# Altium schematic sheet 05-nRF52840.SchDoc: nRF52840
size 297 x 209 mm; Author: Dmitry Shpakov; Organization: NoName; Revision: Revision; PageSize: A4; ProjectName: Project Name
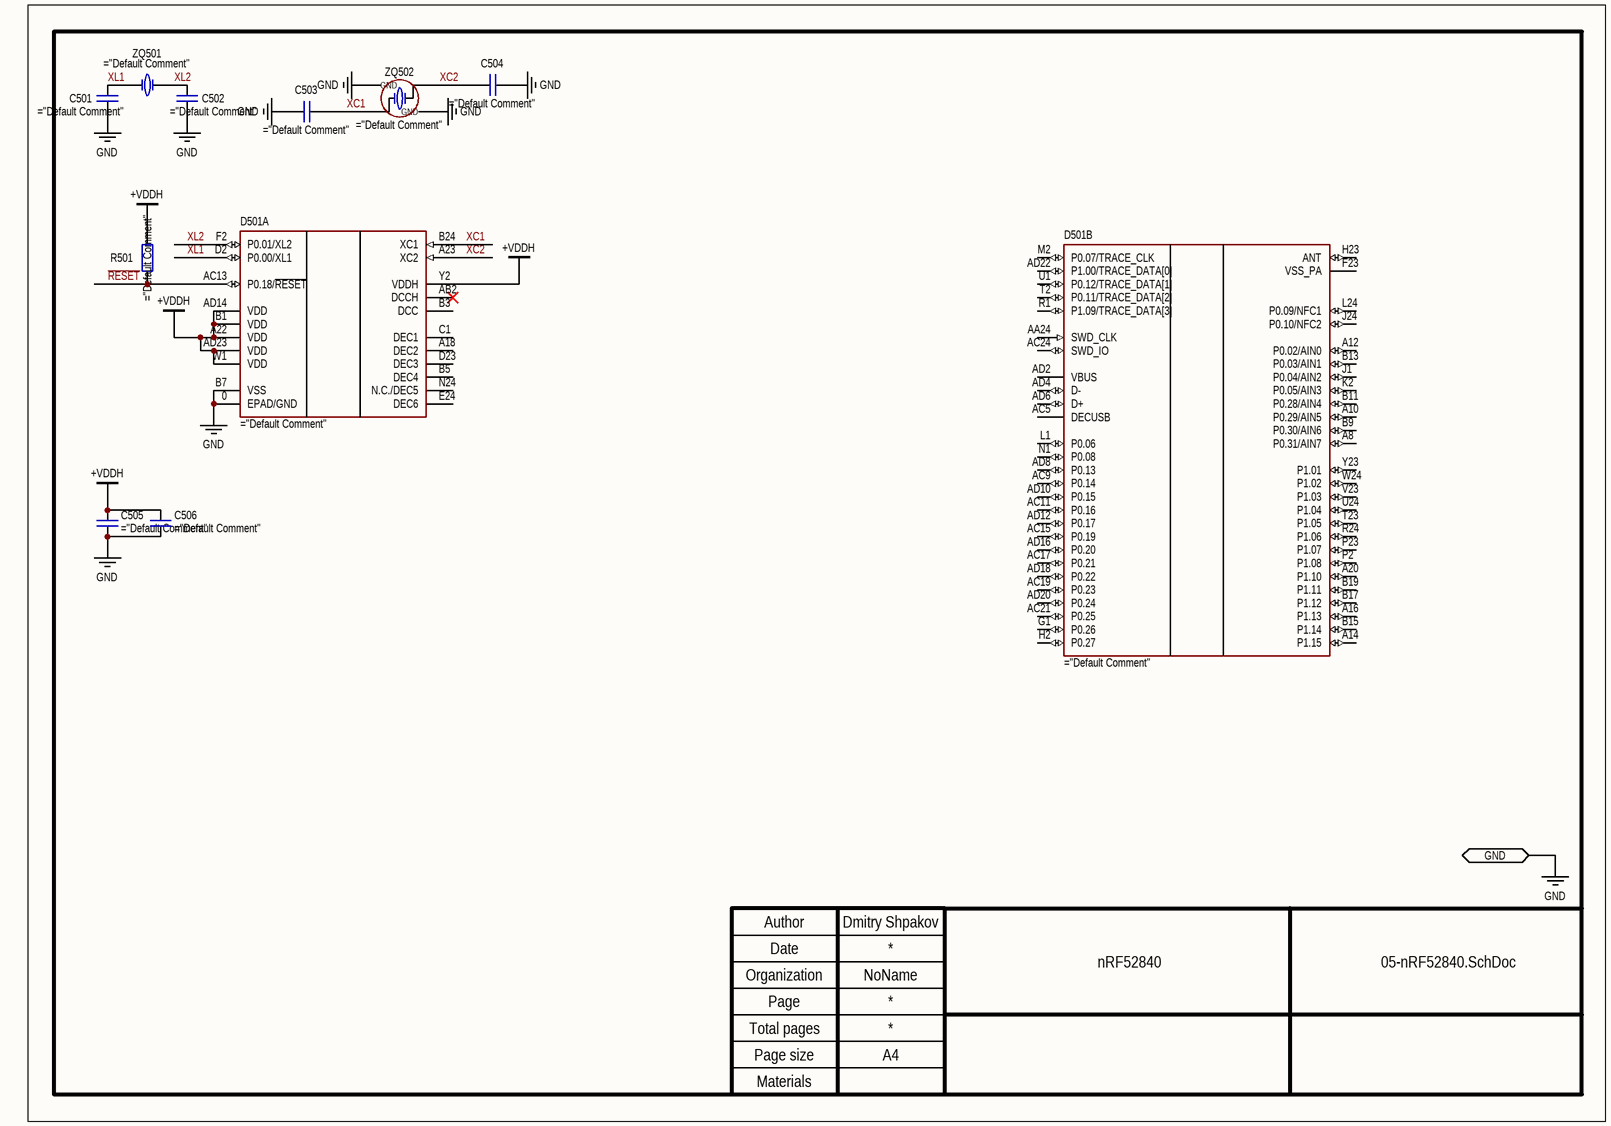
[diagram p0: 05-nRF52840.SchDoc]

## Parts
C501  (no value)  [CAP0402MD]
C502  (no value)  [CAP0402MD]
C503  (no value)  [CAP0402MD]
C504  (no value)  [CAP0402MD]
C505  (no value)  [CAP0603HD]
C506  (no value)  [CAP0603HD]
D501  (no value)  [nRF52840-QIAA]  (parts A,B of 2)
R501  (no value)  [0402]
ZQ501  (no value)  [ECS-.327-9-16-TR]
ZQ502  (no value)  [ECS-320-8-37B-CKY-TR]

## Ports
GND (bidir)

## Nets
+VDDH: C505.2 C506.2 D501.A22(VDD) D501.AD14(VDD) D501.AD23(VDD) D501.B1(VDD) D501.W1(VDD) D501.Y2(VDDH) R501.2
GND: C501.1 C502.1 C503.1 C504.1 C505.1 C506.1 D501.0(EPAD/GND) D501.B7(VSS) ZQ502.2 ZQ502.4 ; port GND
~{RESET}: D501.AC13(P0.18/~{RESET}) R501.1
XC1: C503.2 D501.B24(XC1) ZQ502.1
XC2: C504.2 D501.A23(XC2) ZQ502.3
XL1: C501.2 D501.D2(P0.00/XL1) ZQ501.2
XL2: C502.2 D501.F2(P0.01/XL2) ZQ501.1

Not connected (* = marked no-connect by the designer): D501 A8(P0.31/AIN7) A10(P0.29/AIN5) A12(P0.02/AIN0) A14(P1.15) A16(P1.13) A18(DEC2) A20(P1.10) AA24(SWD_CLK) AB2(DCCH)* AC5(DECUSB) AC9(P0.14) AC11(P0.16) AC15(P0.19) AC17(P0.21) AC19(P0.23) AC21(P0.25) AC24(SWD_IO) AD2(VBUS) AD4(D-) AD6(D+) AD8(P0.13) AD10(P0.15) AD12(P0.17) AD16(P0.20) AD18(P0.22) AD20(P0.24) AD22(P1.00/TRACE_DATA[0]) B3(DCC) B5(DEC4) B9(P0.30/AIN6) B11(P0.28/AIN4) B13(P0.03/AIN1) B15(P1.14) B17(P1.12) B19(P1.11) C1(DEC1) D23(DEC3) E24(DEC6) F23(VSS_PA) G1(P0.26) H2(P0.27) H23(ANT) J1(P0.04/AIN2) J24(P0.10/NFC2) K2(P0.05/AIN3) L1(P0.06) L24(P0.09/NFC1) M2(P0.07/TRACE_CLK) N1(P0.08) N24(N.C./DEC5) P2(P1.08) P23(P1.07) R1(P1.09/TRACE_DATA[3]) R24(P1.06) T2(P0.11/TRACE_DATA[2]) T23(P1.05) U1(P0.12/TRACE_DATA[1]) U24(P1.04) V23(P1.03) W24(P1.02) Y23(P1.01)

## Notes on the sheet
- Author
- Date
- Organization
- Page
- Total pages
- Materials
- Page size
- (in symbol ECS-320-8-37B-CKY-TR) GND

## Library data of the parts
C501-C504 = CC0402JRNPO9BN120: CAP CER 12PF 50V C0G/NPO 0402; Manufacturer: YAGEO; Type: capacitor; Power Dissipation: * W; Rated Current: * A; Tolerance: 5 %; Other: 12 pF ±5% 50V Ceramic Capacitor C0G, NP0 0402 (1005 Metric); Operating Temperature: -55 °C to +125 °C; HelpURL: https://www.digikey.com/en/products/detail/yageo/CC0402JRNPO9BN120/302750; Default Comment: 12 pF; Rated Power: * W; Value: 12 pF; Summary: ="Type"+" "+"Part Number"+" "+"Manufacturer"+" "+"Value"+" "+"Tolerance"+" "+"Operating Temperature"+" "+"Case"+" "+"Power Dissipation"+" "+"Rated Current"+" "+"Rated Power"+" "+"Rated Voltage"+" "+"Other"; Part Number: CC0402JRNPO9BN120; Assembly: *; Case: 0402; Rated Voltage: 50 V
C505 C506 = CC0603KRX7R7BB104: CAP CER 0.1UF 16V X7R 0603; Manufacturer: YAGEO; Type: capacitor; Power Dissipation: * W; Rated Current: * A; Tolerance: 10 %; Other: 0.1 µF ±10% 16V Ceramic Capacitor X7R 0603 (1608 Metric); Operating Temperature: -55 °C to +125 °C; HelpURL: https://www.digikey.com/en/products/detail/yageo/CC0603KRX7R7BB104/302822; Default Comment: 0.1 uF; Rated Power: * W; Value: 0.1 uF; Summary: ="Type"+" "+"Part Number"+" "+"Manufacturer"+" "+"Value"+" "+"Tolerance"+" "+"Operating Temperature"+" "+"Case"+" "+"Power Dissipation"+" "+"Rated Current"+" "+"Rated Power"+" "+"Rated Voltage"+" "+"Other"; Part Number: CC0603KRX7R7BB104; Assembly: *; Case: 0603; Rated Voltage: 16 V
D501 = NRF52840-QIAA-R7: IC RF TXRX+MCU 802.15.4 73VFQFN; Manufacturer: Nordic Semiconductor ASA; Power Dissipation: * W; Rated Voltage: * V; Rated Current: * A; Tolerance: * %; Other: IC RF TxRx + MCU 802.15.4, Bluetooth Bluetooth v5.0, Thread, Zigbee® 2.4GHz 73-VFQFN Dual Rows, Exposed Pad; Case: 73-QFN (7x7); Operating Temperature: -40 °C to +85 °C; Type: IC; HelpURL: https://www.digikey.com/en/products/detail/nordic-semiconductor-asa/NRF52840-QIAA-R7/11200025; Default Comment: NRF52840-QIAA-R7; Rated Power: * W; Value: *; Summary: ="Type"+" "+"Part Number"+" "+"Manufacturer"+" "+"Value"+" "+"Tolerance"+" "+"Operating Temperature"+" "+"Case"+" "+"Power Dissipation"+" "+"Rated Current"+" "+"Rated Power"+" "+"Rated Voltage"+" "+"Other"; Part Number: NRF52840-QIAA-R7; Assembly: *
R501 = RC0402JR-0710KL: RES 10K OHM 5% 1/16W 0402; Manufacturer: YAGEO; Rated Voltage: * V; Rated Current: * A; Other: 10 kOhms ±5% 0.063W, 1/16W Chip Resistor 0402 (1005 Metric) Moisture Resistant Thick Film; Operating Temperature: -55 °C to +155 °C; Type: resistor; HelpURL: https://www.digikey.com/en/products/detail/yageo/RC0402JR-0710KL/726418; Default Comment: 10k; Power Dissipation: 1/16 W; Rated Power: 1/16 W; Tolerance: 5 %; Value: 10k; Summary: ="Type"+" "+"Part Number"+" "+"Manufacturer"+" "+"Value"+" "+"Tolerance"+" "+"Operating Temperature"+" "+"Case"+" "+"Power Dissipation"+" "+"Rated Current"+" "+"Rated Power"+" "+"Rated Voltage"+" "+"Other"; Part Number: RC0402JR-0710KL; Assembly: *; Case: 0402
ZQ501 = ECS-.327-9-16-TR: CRYSTAL 32.7680KHZ 9PF SMD; Manufacturer: ECS Inc.; Default Comment: 32.768 kHz; Power Dissipation: * W; Rated Voltage: * V; Rated Current: * A; Tolerance: 20 ppm; Value: 32.768 kHz; Other: 32.768 kHz ±20ppm Crystal 9pF 90 kOhms 2-SMD, No Lead; Case: 2-SMD; Operating Temperature: -40 °C to +85 °C; Type: Oscillator; HelpURL: https://www.digikey.com/en/products/detail/ecs-inc/ECS-327-9-16-TR/5875558; Rated Power: * W; Summary: ="Type"+" "+"Part Number"+" "+"Manufacturer"+" "+"Value"+" "+"Tolerance"+" "+"Operating Temperature"+" "+"Case"+" "+"Power Dissipation"+" "+"Rated Current"+" "+"Rated Power"+" "+"Rated Voltage"+" "+"Other"; Part Number: ECS-.327-9-16-TR; Assembly: *
ZQ502 = ECS-320-8-37B-CKY-TR: CRYSTAL 32.0000MHZ 8PF SMD; Manufacturer: ECS Inc.; Power Dissipation: * W; Rated Voltage: * V; Rated Current: * A; Tolerance: 10 ppm; Other: 32 MHz ±10ppm Crystal 8pF 50 Ohms 4-SMD, No Lead; Case: 4-SMD; Operating Temperature: -30 °C to +85 °C; Type: Oscillator; HelpURL: https://www.digikey.com/en/products/detail/ecs-inc/ECS-320-8-37B-CKY-TR/9838854; Default Comment: 32.0000 MHz; Rated Power: * W; Value: 32.0000 MHz; Summary: ="Type"+" "+"Part Number"+" "+"Manufacturer"+" "+"Value"+" "+"Tolerance"+" "+"Operating Temperature"+" "+"Case"+" "+"Power Dissipation"+" "+"Rated Current"+" "+"Rated Power"+" "+"Rated Voltage"+" "+"Other"; Part Number: ECS-320-8-37B-CKY-TR; Assembly: *